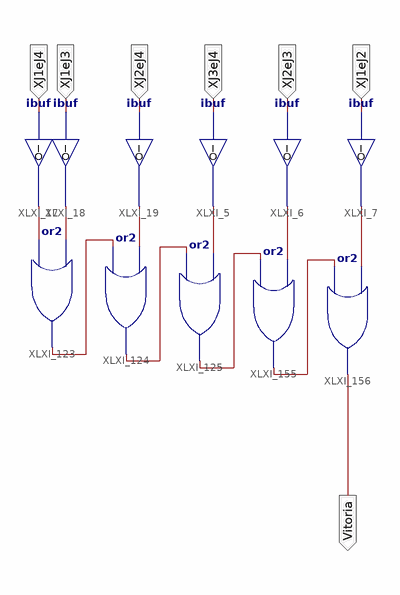
[diagram p0: schematic sheet 1]
// Xilinx ISE schematic ciscuito2p2teste.sch (spartan6) as structural Verilog: 11 symbols, 7 ports
module ciscuito2p2teste (
  input  XJ1eJ4,
  input  XJ1eJ3,
  input  XJ2eJ4,
  input  XJ3eJ4,
  input  XJ2eJ3,
  input  XJ1eJ2,
  output Vitoria
);

  wire XLXN_84, XLXN_85, XLXN_116, XLXN_117, XLXN_118, XLXN_119, XLXN_121, XLXN_122, XLXN_131, XLXN_132;

  ibuf XLXI_17 (.I(XJ1eJ4), .O(XLXN_116));
  or XLXI_123 (XLXN_84, XLXN_116, XLXN_117);
  or XLXI_124 (XLXN_85, XLXN_84, XLXN_118);
  or XLXI_125 (XLXN_121, XLXN_85, XLXN_119);
  ibuf XLXI_18 (.I(XJ1eJ3), .O(XLXN_117));
  ibuf XLXI_19 (.I(XJ2eJ4), .O(XLXN_118));
  ibuf XLXI_5 (.I(XJ3eJ4), .O(XLXN_119));
  or XLXI_155 (XLXN_122, XLXN_121, XLXN_131);
  or XLXI_156 (Vitoria, XLXN_122, XLXN_132);
  ibuf XLXI_6 (.I(XJ2eJ3), .O(XLXN_131));
  ibuf XLXI_7 (.I(XJ1eJ2), .O(XLXN_132));
endmodule
